# EAGLE design RELIP_reader_withoutVias (EAGLE 9.6.2)
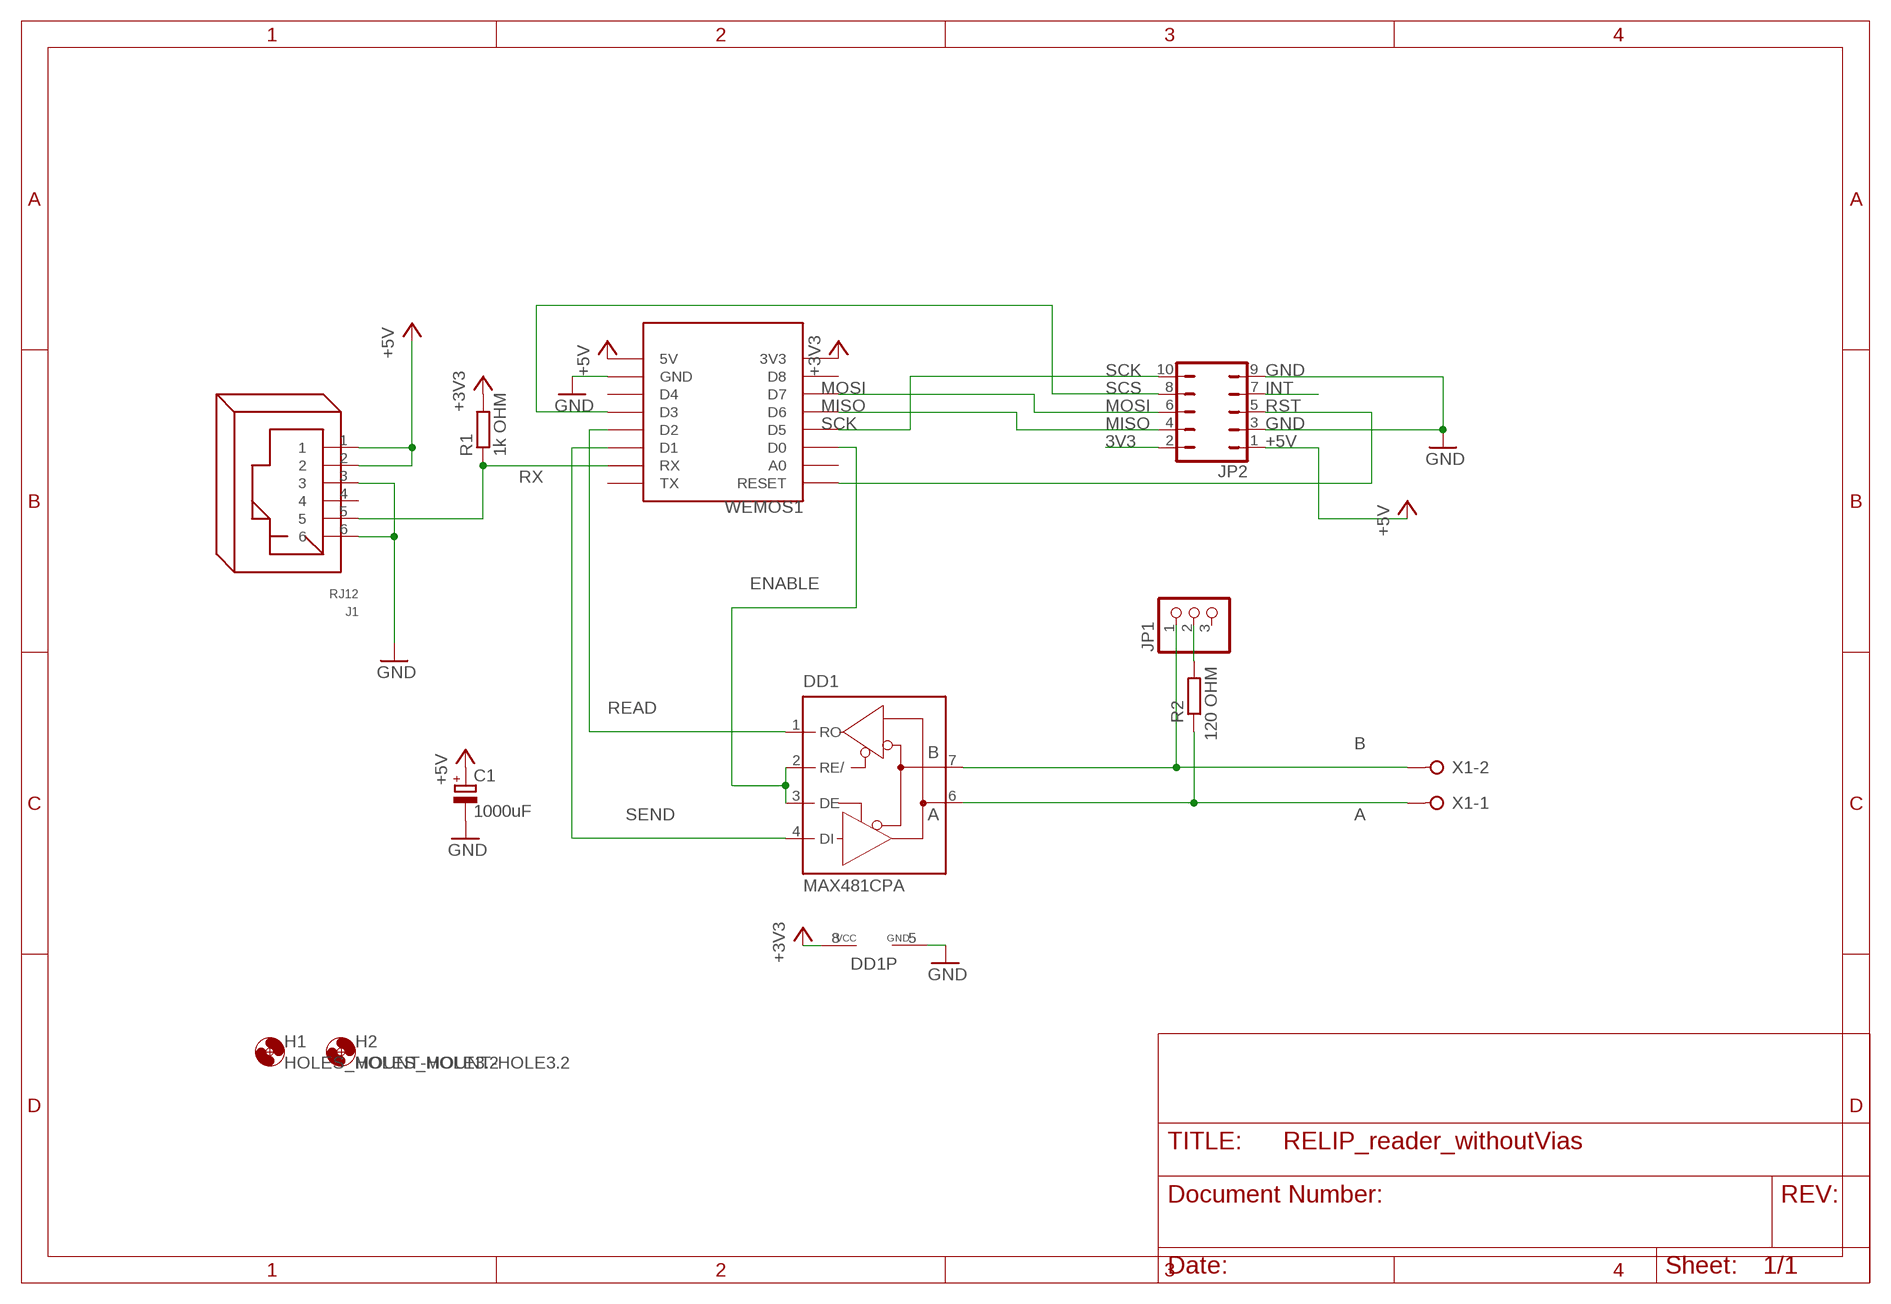
[diagram p0: schematic, sheet 1]

## Parts
C1  1000uF  CPOL-EUE3.5-8  [E3,5-8]
DD1  MAX481CPA  [DIL08]
H1  HOLES_MOUNT-HOLE3.2  [HOLES_3,2]
H2  HOLES_MOUNT-HOLE3.2  [HOLES_3,2]
J1  RJ12  [RJ12]
JP1  PINHEAD_PINHD-1X3  [PINHEAD_1X03]
JP2  JP5Q  [JP5Q]
R1  1k OHM  RCL_R-EU_0207/12  [RCL_0207/12]
R2  120 OHM  RCL_R-EU_0207/12  [RCL_0207/12]
WEMOS1  WEMOS-D1-MINI  [WEMOS-D1-MINI]
X1  W237-02P  [W237-132]

## Nets
3V3: JP2.2
+3V3: DD1.8(VCC) R1.2 WEMOS1.3V3
+5V: C1.+ J1.1 J1.2 JP2.1 WEMOS1.5V
A: DD1.6(A) R2.1 X1.1
B: DD1.7(B) JP1.1 X1.2
ENABLE: DD1.2(RE/) DD1.3(DE) WEMOS1.D0
GND: C1.- DD1.5(GND) J1.3 J1.6 JP2.3 JP2.9 WEMOS1.GND
INT: JP2.7
MISO: JP2.4 WEMOS1.D6
MOSI: JP2.6 WEMOS1.D7
N$7: JP1.2 R2.2
READ: DD1.1(RO) WEMOS1.D2
RST: JP2.5 WEMOS1.RESET
RX: J1.5 R1.1 WEMOS1.RX
SCK: JP2.10 WEMOS1.D5
SCS: JP2.8 WEMOS1.D3
SEND: DD1.4(DI) WEMOS1.D1
Unconnected: J1.4 JP1.3 WEMOS1.A0 WEMOS1.D4 WEMOS1.D8 WEMOS1.TX

## Library data of the parts
C1 = rcl:CPOL-EU: POLARIZED CAPACITOR, European symbol; SPICEPREFIX: C
DD1 = rs232-rs485:MAX481CPA: RS485 TRANSEIVER
H1 H2 = Max485_Max232-1:HOLES_MOUNT-HOLE: MOUNTING HOLE with drill center marker
J1 = con-rj:RJ12: RJ12, RJ14 and RJ25 RJ12, RJ14 and RJ25 jacks side mounted http://www.tycoelectronics.com
JP1 = Max485_Max232-1:PINHEAD_PINHD-1X3: PIN HEADER
JP2 = jumper:JP5Q: JUMPER
R1 R2 = Recorder_AD_DA_converter_6:RCL_R-EU_: RESISTOR, European symbol
WEMOS1 = esp8266modules:WEMOS-D1-MINI: WeMos.cc D1 mini ESP8266 module
X1 = con-wago-508:W237-02P: WAGO SREW CLAMP; OC_FARNELL: unknown; OC_NEWARK: unknown

## Board
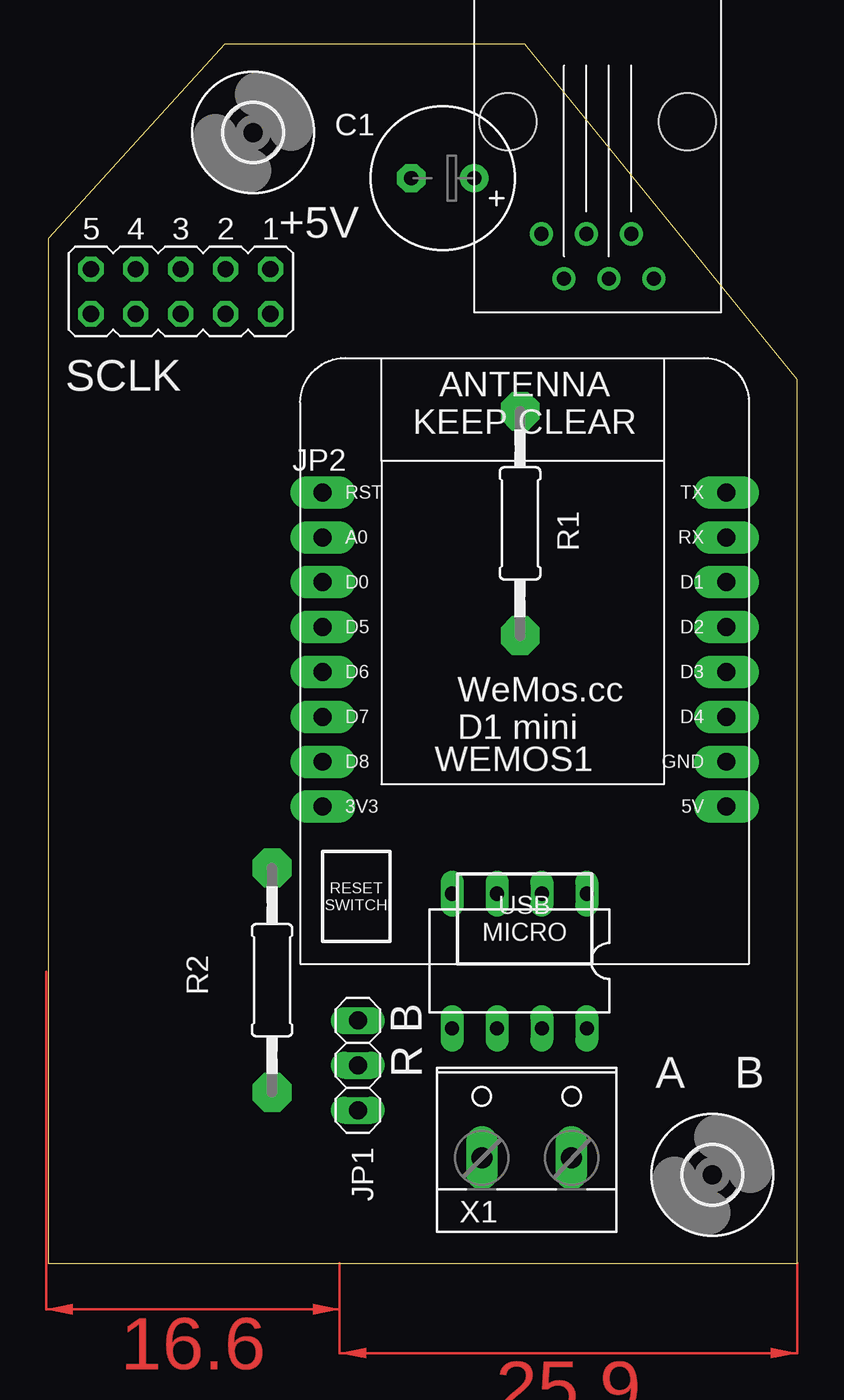
[diagram p1: board, top side]
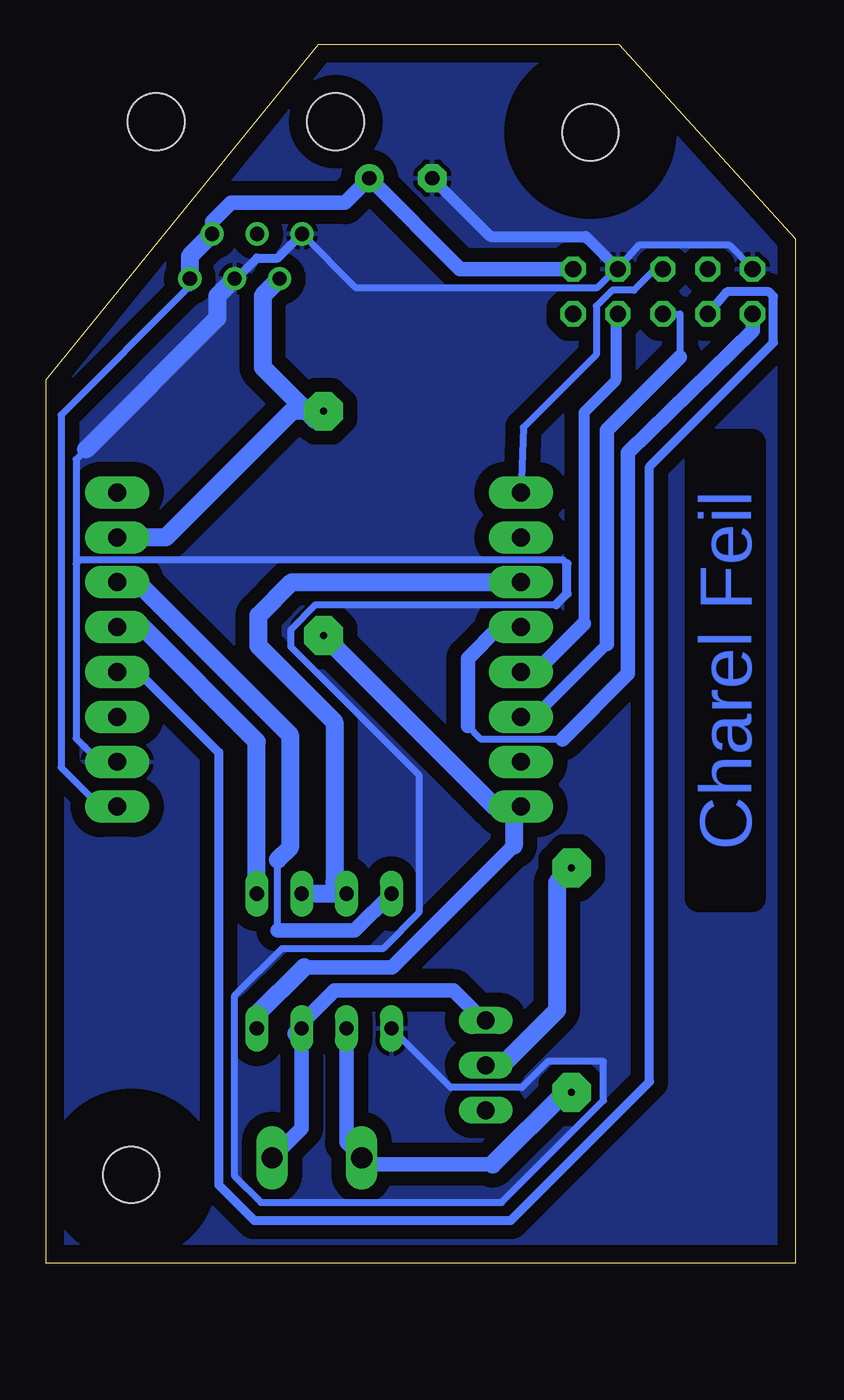
[diagram p2: board, bottom side, seen from below]

Size 42.4 x 69 mm. Coordinates in mm from the lower left corner, seen from the top.
Outline: 42.4,0 42.4,50 27,69 10,69 0,58 0,0 42.4,0
Copper layers (1*16): Top 0.035mm / dielectric 1.5mm / Bottom 0.035mm
Design rules "default *": minimum track width 0.4mm, minimum drill 0.35mm, track to track 6mil, track to pad 6mil, pad to pad 6mil, via to via 6mil, smd to smd 6mil, copper to edge 40mil, drill to drill 6mil, minimum pad ring 10mil, minimum via ring 1mm, stop-mask expansion 4mil, vias tented up to drill 0mil, thermal gap 10mil

### Footprints (pad centres in the part's own frame; a part is rotated, then mirrored left to right if it is on the bottom)
E3,5-8 = drill 0.813 pad 1.6: + -1.778,0 | drill 0.813 pad 1.6 octagon: - 1.778,0
DIL08 = drill 0.8 long: 1 -3.81,-3.81; 2 -1.27,-3.81; 3 1.27,-3.81; 4 3.81,-3.81; 5 3.81,3.81; 6 1.27,3.81; 7 -1.27,3.81; 8 -3.81,3.81
HOLES_3,2 = hole 3.2: 0,0
RJ12 = drill 0.8: 1 -8.89,-3.175; 2 -6.35,-1.905; 3 -8.89,-0.635; 4 -6.35,0.635; 5 -8.89,1.905; 6 -6.35,3.175 | hole 3.25: 0,-5.08; 0,5.08
PINHEAD_1X03 = drill 1.016 long: 1 -2.54,0; 2 0,0; 3 2.54,0
JP5Q = drill 0.914 octagon: 1 -5.08,-1.27; 2 -5.08,1.27; 3 -2.54,-1.27; 4 -2.54,1.27; 5 0,-1.27; 6 0,1.27; 7 2.54,-1.27; 8 2.54,1.27; 9 5.08,-1.27; 10 5.08,1.27
RCL_0207/12 = drill 0.406 pad 2.184 octagon: 1 -6.35,0; 2 6.35,0
WEMOS-D1-MINI = drill 1.016 pad 1.829 long: 3V3 -10.16,-10.16; 5V 12.7,-10.16; A0 -10.16,5.08; D0 -10.16,2.54; D1 12.7,2.54; D2 12.7,0; D3 12.7,-2.54; D4 12.7,-5.08; D5 -10.16,0; D6 -10.16,-2.54; D7 -10.16,-5.08; D8 -10.16,-7.62; GND 12.7,-7.62; RESET -10.16,7.62; RX 12.7,5.08; TX 12.7,7.62
W237-132 = drill 1.194 long: 1 -2.54,-0.635; 2 2.54,-0.635

### Placement (x,y rotation side)
C1  22.34,61.42 180 top
DD1  26.68,17.1 180 top
H1  37.6,5 0 top
H2  11.6,64 0 top
J1  31.11,64.61 90 top
JP1  17.53,11.2 270 top
JP2  7.5,55 180 top
R1  26.71,41.88 270 top
R2  12.67,16.02 90 top
WEMOS1  25.7,36 0 top
X1  27.09,6.6 0 top

### Tracks (layer width: path | path; a pad name or v marks a point on that pad's centre or on a via)
+3V3
  Bottom 0.813: 15.95,23.64 22.84,16.75 27.81,16.75
  Bottom 1.016: R1.2 17.03,25.84 WEMOS1.3V3 15.95,25.29 15.95,23.64 | DD1.8 30.49,14.07 27.81,16.75
+5V
  Bottom 0.406: 39.35,25.84 41.58,28.07 41.58,48.01 34.28,55.31
  Bottom 0.61: J1.1 34.28,55.31
  Bottom 0.813: JP2.1 18.98,56.28 C1.+ 25.51,60.02 31.93,60.02 33.01,58.95 J1.2
  Bottom 1.016: J1.2 34.28,56.99 J1.1 | 39.35,25.84 WEMOS1.5V
A
  Bottom 0.813: 17.14,5.59 24.17,5.59 X1.1 25.41,6.83 DD1.6
  Bottom 1.016: 17.14,5.59 13.06,9.67 R2.1
B
  Bottom 0.813: JP1.1 17.65,13.74 19.34,15.43 26.08,15.43 27.95,13.57 DD1.7 27.95,7.64 X1.2
  Bottom 1.016: DD1.7 28.24,13
ENABLE
  Bottom 1.016: DD1.2 DD1.3 26.1,21.6 26.1,30.64 30.39,34.94 30.39,36.66 28.51,38.54 WEMOS1.D0
GND
  Bottom 0.4: 12.93,39.6 13.14,39.81 14.3,39.81
  Bottom 0.406: 13.54,37.27 27.15,37.27 28.57,35.85 28.57,34.89 21.31,27.63 21.31,19.84 23.35,17.8 29.08,17.8 31.76,15.12 31.76,4.95 30.25,3.44 16.64,3.44 10.86,9.21 10.86,11.41 14.01,11.41 15.48,9.95 19.52,9.95 DD1.5 | JP2.9 2.51,56.41 3.72,57.61 8.86,57.61 JP2.3 10.17,56.27 11.24,55.2 24.87,55.2 J1.6 | WEMOS1.GND 39.4,28.38 40.72,29.71 40.72,39.6 | 40.15,46.06 40.72,45.49 40.72,39.6 | 40.72,39.6 40.51,39.81 14.3,39.81 13.82,39.81
  Bottom 0.508: J1.3 31.65,55.72 30.48,56.89 29.3,56.89 J1.6 | 13.54,37.27 12.93,37.89 12.93,39.6 | 10.15,56.41 JP2.3
  Bottom 0.61: 10.15,56.41 11.86,58.12 17.26,58.12 C1.-
  Bottom 1.016: J1.3 32.73,54.74 32.73,53.49 40.15,46.06
  pour Bottom (isolate 0.813): 10.04,68.89 26.95,68.89 42.33,50.14 42.49,49.91 42.49,-0.14 0.28,-0.14 0.14,0 0.14,58.02 -0.14,58.3 10.04,68.47
MISO
  Bottom 0.508: 14.71,33.46 WEMOS1.D6
  Bottom 0.61: JP2.4 10.16,53.77 10.16,49.96 11.96,48.16 11.96,36.21
  Bottom 0.813: 14.71,33.46 11.96,36.21
MOSI
  Bottom 0.406: JP2.6 6.53,53.72 6.53,51.29
  Bottom 0.61: 14.79,30.92 10.66,35.06
  Bottom 0.813: 10.66,35.06 10.66,47.16 6.53,51.29
  Bottom 1.016: 14.79,30.92 WEMOS1.D7
N$7
  Bottom 1.016: JP1.2 16.61,11.2 13.5,14.31 13.5,21.55 R2.2
READ
  Bottom 1.016: WEMOS1.D2 36.97,36 30.49,29.53 DD1.1
RST
  Bottom 0.406: WEMOS1.RESET 15.39,47.3 11.27,51.43 11.27,54.17 10.37,55.07 9.14,55.07 7.8,56.41 JP2.5
RX
  Bottom 0.406: R1.1 27.19,47.74
  Bottom 1.016: R1.1 28.5,48.23 35.64,41.08 WEMOS1.RX | J1.5 30.16,54.76 30.16,50.71 27.19,47.74
SCK
  Bottom 0.406: 18.54,30.4 17.8,29.65 13.2,29.65
  Bottom 0.813: 13.2,29.65 9.49,33.36 9.49,45.87 2.42,52.78 JP2.10 | WEMOS1.D5 16.78,36 18.54,34.24 18.54,30.4
SCS
  Bottom 0.508: WEMOS1.D3 37.2,33.46 32.65,28.91 32.65,4.42 30.64,2.42 16.11,2.42 8.26,10.26 8.26,45.09 1.24,52.11 1.24,54.73 1.5,54.98 3.87,54.98 JP2.8
SEND
  Bottom 0.406: 37.26,38.54 WEMOS1.D1 | 29.31,18.84 29.31,22.82
  Bottom 0.813: DD1.4 24.95,18.84 29.31,18.84
  Bottom 1.016: 37.26,38.54 28.62,29.9 28.62,23.51 29.31,22.82
(copper drawn outside any net)
  shapes: Top area x2

### Text on the board
Bottom: Charel Feil
tNames: +5V | SCLK | R B | A B
Document: Charel Feil
tDocu: 1